# EAGLE design ESP-Breakout (EAGLE 7.3.0)
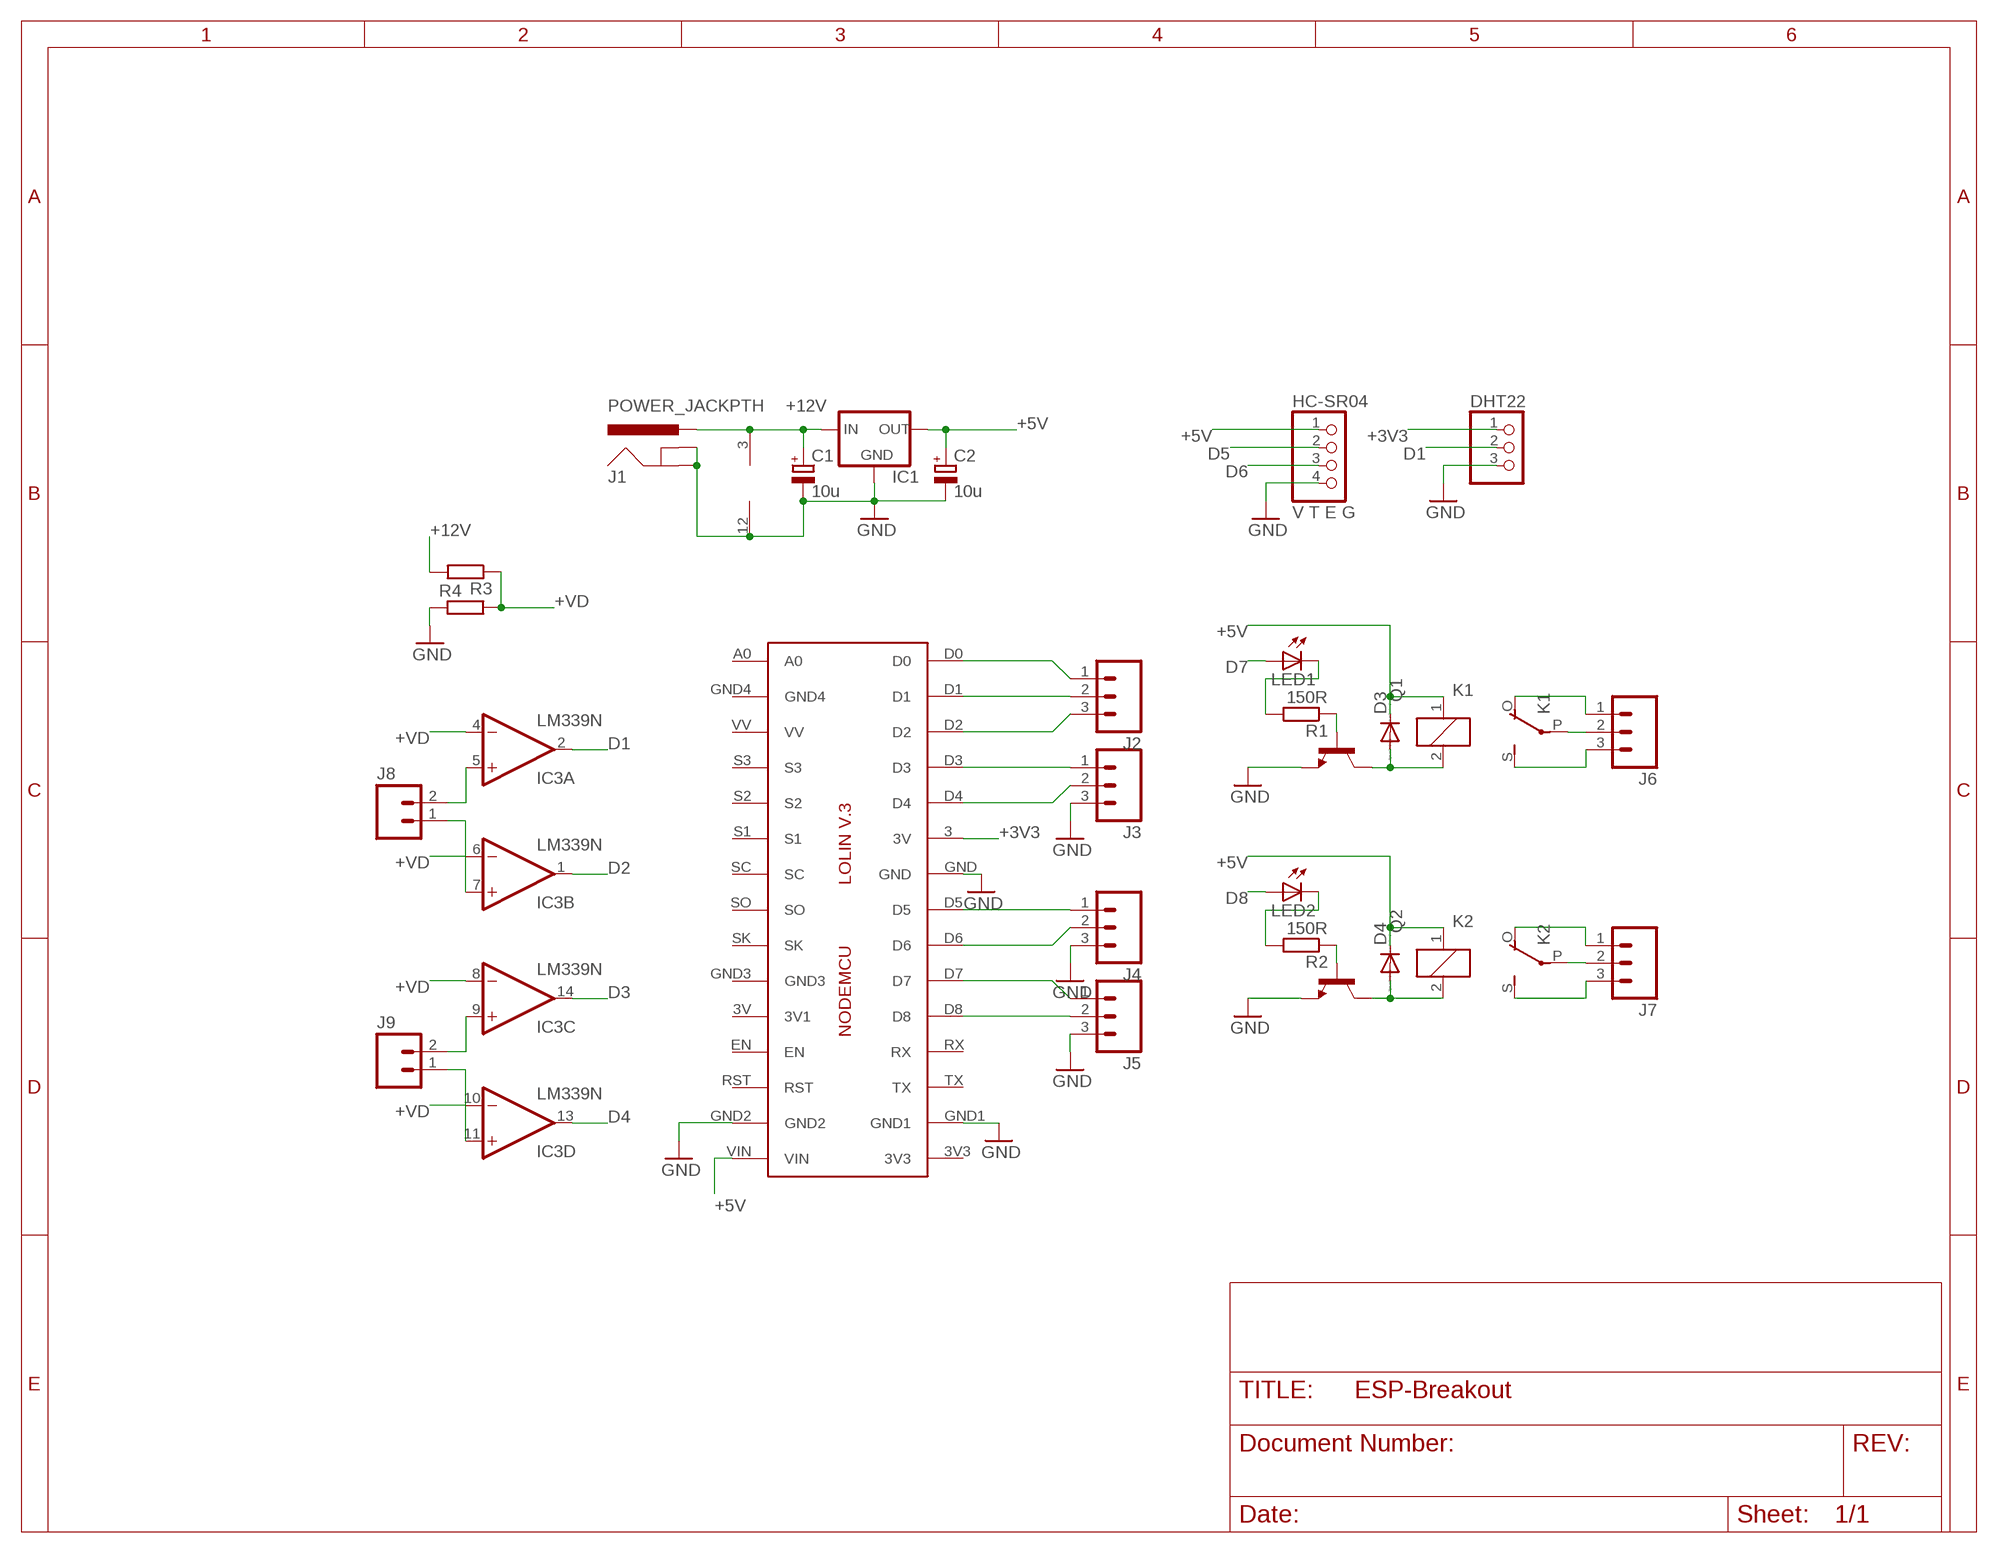
[diagram p0: schematic, sheet 1]

## Parts
C1  10u  CPOL-EUA/3216-18W  [A/3216-18W]
C2  10u  CPOL-EUA/3216-18W  [A/3216-18W]
D3  DIODE-DO214AC  [DO214AC]
D4  DIODE-DO214AC  [DO214AC]
DHT22  PINHD-1X3/90  [1X03/90]
HC-SR04  V T E G  PINHD-1X4  [1X04]
IC1  LM1117  [SOT223]
IC2  LOLINV3  [LOLINV3]
IC3  LM339N  [DIL14]
J1  POWER_JACKPTH  [POWER_JACK_PTH]
J2  M03-SCREW-5MM  [SCREWTERMINAL-5MM-3]
J3  M03-SCREW-5MM  [SCREWTERMINAL-5MM-3]
J4  M03-SCREW-5MM  [SCREWTERMINAL-5MM-3]
J5  M03-SCREW-5MM  [SCREWTERMINAL-5MM-3]
J6  M03-SCREW-5MM  [SCREWTERMINAL-5MM-3]
J7  M03-SCREW-5MM  [SCREWTERMINAL-5MM-3]
J8  M025MM  [SCREWTERMINAL-5MM-2]
J9  M025MM  [SCREWTERMINAL-5MM-2]
K1  ZF112  [ZF112]
K2  ZF112  [ZF112]
LED1  LEDCHIP-LED0805  [CHIP-LED0805]
LED2  LEDCHIP-LED0805  [CHIP-LED0805]
Q1  BC850SMD  [SOT23-BEC]
Q2  BC850SMD  [SOT23-BEC]
R1  150R  R-EU_R0805  [R0805]
R2  150R  R-EU_R0805  [R0805]
R3  R-EU_0204/7  [0204/7]
R4  R-EU_0204/7  [0204/7]

## Nets
+3V3: DHT22.1 IC2.3(3V)
+5V: C2.+ D3.C D4.C HC-SR04.1 IC1.2(OUT) IC2.VIN K1.1 K2.1
+12V: C1.+ IC1.3(IN) IC3.3(P:V+) J1.PWR R3.2
+VD: IC3.4(A:-IN) IC3.6(B:-IN) IC3.8(C:-IN) IC3.10(D:-IN) R3.1 R4.2
D0: IC2.D0 J2.1
D1: DHT22.2 IC2.D1 IC3.2(A:OUT) J2.2
D2: IC2.D2 IC3.1(B:OUT) J2.3
D3: IC2.D3 IC3.14(C:OUT) J3.1
D4: IC2.D4 IC3.13(D:OUT) J3.2
D5: HC-SR04.2 IC2.D5 J4.1
D6: HC-SR04.3 IC2.D6 J4.2
D7: IC2.D7 J5.1 LED1.A
D8: IC2.D8 J5.2 LED2.A
GND: C1.- C2.- DHT22.3 HC-SR04.4 IC1.1(GND) IC2.GND IC2.GND1 IC2.GND2 IC3.12(P:GND) J1.GND J1.GNDBREAK J3.3 J4.3 J5.3 Q1.E Q2.E R4.1
N$1: IC3.5(A:+IN) J8.2
N$2: IC3.7(B:+IN) J8.1
N$3: IC3.9(C:+IN) J9.2
N$4: IC3.11(D:+IN) J9.1
N$11: J6.2 K1.P(2:P)
N$12: J6.3 K1.S(2:S)
N$13: J6.1 K1.O(2:O)
N$14: J7.2 K2.P(2:P)
N$15: J7.1 K2.O(2:O)
N$16: J7.3 K2.S(2:S)
N$18: D3.A K1.2 Q1.C
N$19: D4.A K2.2 Q2.C
N$23: Q1.B R1.1
N$24: Q2.B R2.1
N$25: LED1.C R1.2
N$26: LED2.C R2.2
Unconnected: IC2.3V3 IC2.3V(3V1) IC2.A0 IC2.EN IC2.GND3 IC2.GND4 IC2.RST IC2.RX IC2.S1 IC2.S2 IC2.S3 IC2.SC IC2.SK IC2.SO IC2.TX IC2.VV

## Library data of the parts
C1 C2 = rcl:CPOL-EU: POLARIZED CAPACITOR, European symbol
D3 D4 = diode:DIODE-: DIODE
DHT22 = pinhead:PINHD-1X3: PIN HEADER
HC-SR04 = pinhead:PINHD-1X4: PIN HEADER
IC1 = v-reg-3:LM1117
IC2 = Lolin:LOLINV3
IC3 = linear:LM339: Low Power Low Offset Voltage Quad Comparators with open collector; LM139/LM239/LM339/LM2901/LM3302
J1 = SparkFun-Connectors:POWER_JACK: Power Jack This is the standard 5.5mm barrel jack for power. The PTH is the most common, proven, reliable, footprint. The Slot footprint only works if the mill layer is transmitted to the PCB fab house so be warned. Mating wall wart : TOL-00298 (and others); PROD_ID: CONN-08197
J2-J7 = SparkFun-Connectors:M03: Header 3 Standard 3-pin 0.1" header. Use with straight break away headers (SKU : PRT-00116), right angle break away headers (PRT-00553), swiss pins (PRT-00743), machine pins (PRT-00117), and female headers (PRT-00115). Molex polarized connector foot print use with SKU : PRT-08232 with associated crimp pins and housings.; STOREFRONT_ID: PRT-08433
J8 J9 = SparkFun-Connectors:M02: Standard 2-pin 0.1" header. Use with - straight break away headers ( PRT-00116) - right angle break away headers (PRT-00553) - swiss pins (PRT-00743) - machine pins (PRT-00117) - female headers (PRT-00115) Molex polarized connector foot print use with: PRT-08233 with associated crimp pins and housings. 2.54_SCREWTERM for use with PRT-10571. 3.5mm Screw Terminal footprints for PRT-08084 5mm Screw Terminal footprints for use with PRT-08432; STOREFRONT_ID: PRT-08432
K1 K2 = relay:ZF112: RELAY 1 x switch; OC_FARNELL: unknown; OC_NEWARK: unknown
LED1 LED2 = led:LED: LED OSRAM: - CHIPLED LG R971, LG N971, LY N971, LG Q971, LY Q971, LO R971, LY R971 LH N974, LH R974 LS Q976, LO Q976, LY Q976 LO Q996 - Hyper CHIPLED LW Q18S LB Q993, LB Q99A, LB R99A - SideLED LS A670, LO A670, LY A670, LG A670, LP A670 LB A673, LV A673, LT A673, LW A673 LH A674 LY A675 LS A676, LA A676, LO A676, LY A676, LW A676 LS A679, LY A679, LG A679 - Hyper Micro SIDELED® LS Y876, LA Y876, LO Y876, LY Y876 LT Y87S - SmartLED LW L88C, LW L88S LB L89C, LB L89S, LG L890 LS L89K, LO L89K, LY L89K LS L896, LA L896, LO L896, LY L896 - TOPLED LS T670, LO T670, LY T670, LG T670, LP T670 LSG T670, LSP T670, LSY T670, LOP T670, LYG T670 LG T671, LOG T671, LSG T671 LB T673, LV T673, LT T673, LW T673 LH T674 LS T676, LA T676, LO T676, LY T676, LB T676, LH T676, LSB T676, LW T676 LB T67C, LV T67C, LT T67C, LS T67K, LO T67K, LY T67K, LW E67C LS E67B, LA E67B, LO E67B, LY E67B, LB E67C, LV E67C, LT E67C LW T67C LS T679, LY T679, LG T679 LS T770, LO T770, LY T770, LG T770, LP T770 LB T773, LV T773, LT T773, LW T773 LH T774 LS E675, LA E675, LY E675, LS T675 LS T776, LA T776, LO T776, LY T776, LB T776 LHGB T686 LT T68C, LB T68C - Hyper Mini TOPLED® LB M676 - Mini TOPLED Santana® LG M470 LS M47K, LO M47K, LY M47K Source: http://www.osram.convergy.de LUXEON: - LUMILED® LXK2-PW12-R00, LXK2-PW12-S00, LXK2-PW14-U00, LXK2-PW14-V00 LXK2-PM12-R00, LXK2-PM12-S00, LXK2-PM14-U00 LXK2-PE12-Q00, LXK2-PE12-R00, LXK2-PE12-S00, LXK2-PE14-T00, LXK2-PE14-U00 LXK2-PB12-K00, LXK2-PB12-L00, LXK2-PB12-M00, LXK2-PB14-N00, LXK2-PB14-P00, LXK2-PB14-Q00 LXK2-PR12-L00, LXK2-PR12-M00, LXK2-PR14-Q00, LXK2-PR14-R00 LXK2-PD12-Q00, LXK2-PD12-R00, LXK2-PD12-S00 LXK2-PH12-R00, LXK2-PH12-S00 LXK2-PL12-P00, LXK2-PL12-Q00, LXK2-PL12-R00 Source: www.luxeon.com KINGBRIGHT: KA-3528ASYC Source: www.kingbright.com
Q1 Q2 = transistor-npn:BC850*: NPN Transistor
R1-R4 = rcl:R-EU_: RESISTOR, European symbol

## Board
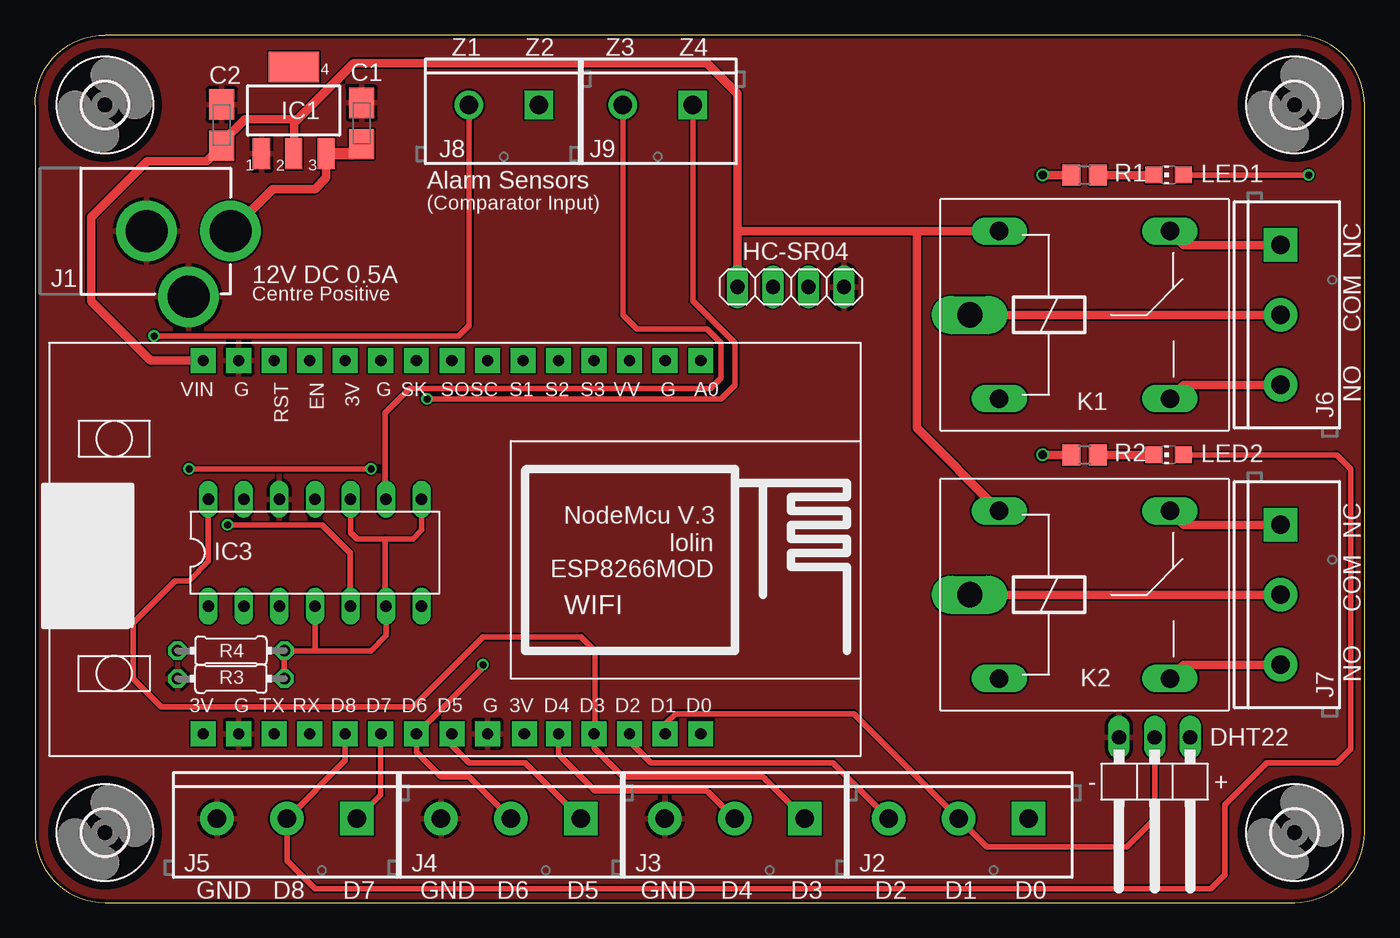
[diagram p1: board, top side]
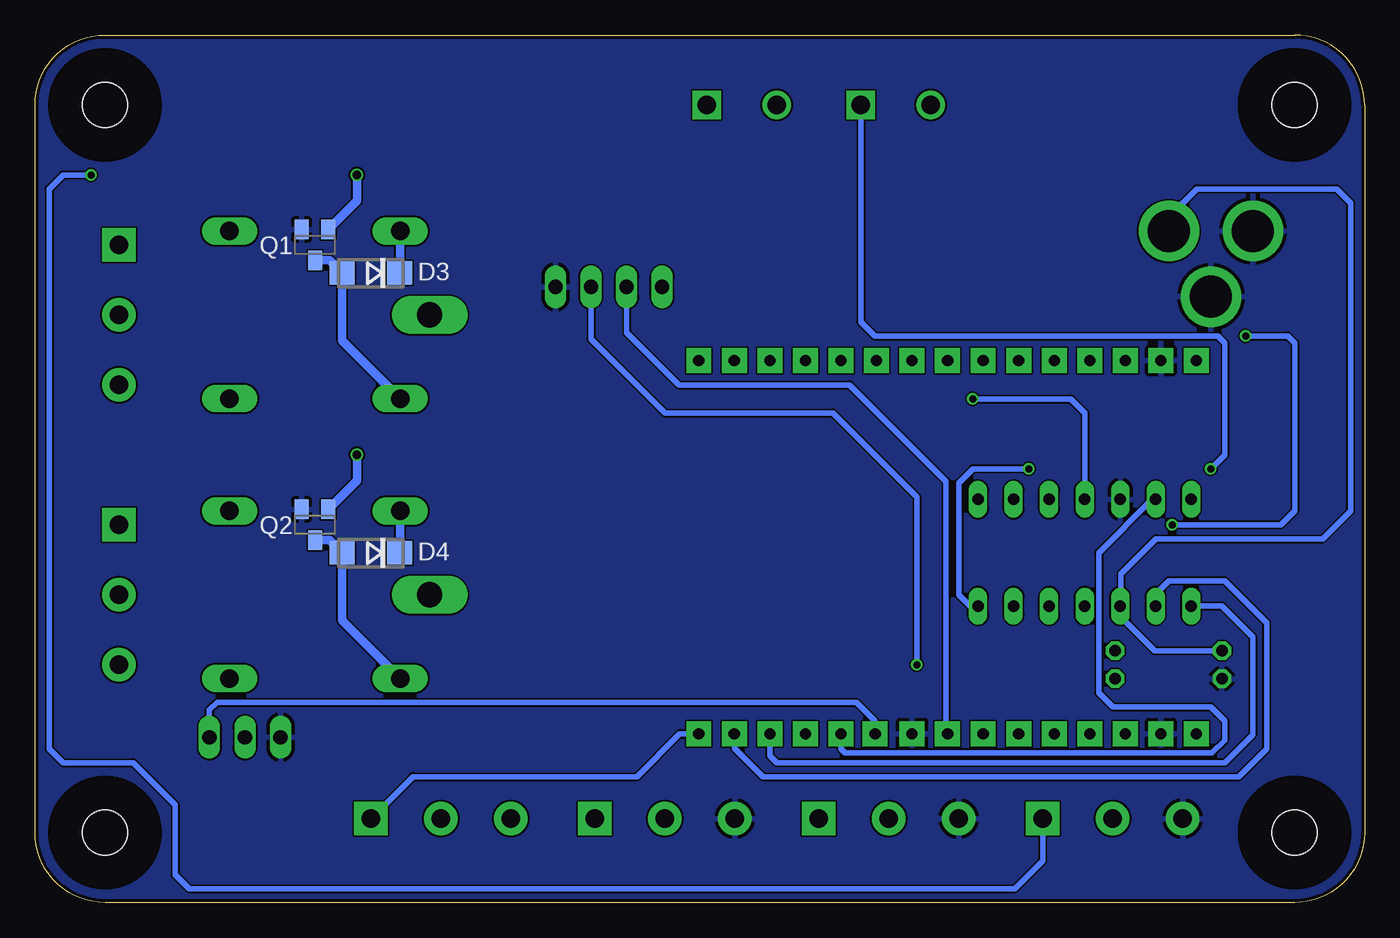
[diagram p2: board, bottom side, seen from below]

Size 95 x 62 mm. Coordinates in mm from the lower left corner, seen from the top.
Outline: 5,0 90,0 arc90 95,5 95,57 arc90 90,62 5,62 arc90 0,57 0,5 arc90 5,0
Copper layers (1*16): Top 0.035mm / dielectric 1.5mm / Bottom 0.035mm
Design rules "dirt_cheap_dirty_boards.v1": minimum track width 5mil, minimum drill 12mil, track to track 5mil, track to pad 5mil, pad to pad 5mil, via to via 5mil, smd to smd 0mil, copper to edge 10mil, drill to drill 10mil, minimum pad ring 10mil, minimum via ring 6mil, stop-mask expansion 2mil, vias tented up to drill 25mil, thermal gap 10mil

### Footprints (pad centres in the part's own frame; a part is rotated, then mirrored left to right if it is on the bottom)
A/3216-18W = smd 2.15 x 1.8: + 1.475,0; - -1.475,0
DO214AC = smd 1.8 x 1.7: A 2.05,0; C -2.05,0
1X03/90 = drill 1.016 long: 1 -2.54,-3.81; 2 0,-3.81; 3 2.54,-3.81
1X04 = drill 1.016 long: 1 -3.81,0; 2 -1.27,0; 3 1.27,0; 4 3.81,0
SOT223 = smd 1.219 x 2.235: 1 -2.311,-3.099; 2 0,-3.099; 3 2.311,-3.099 | smd 3.6 x 2.2: 4 0,3.099
LOLINV3 = drill 0.8 pad 1.778 square: 3 -4.97,12.94; 3V 17.99,12.94; 3V3 7.83,-13.73; A0 -17.57,-13.73; D0 -17.57,12.94; D1 -15.03,12.94; D2 -12.49,12.94; D3 -9.95,12.94; D4 -7.41,12.94; D5 0.21,12.94; D6 2.75,12.94; D7 5.29,12.94; D8 7.83,12.94; EN 10.37,-13.73; GND -2.33,12.94; GND1 15.45,12.94; GND2 15.45,-13.73; GND3 5.29,-13.73; GND4 -15.03,-13.73; RST 12.91,-13.73; RX 10.37,12.94; S1 -4.87,-13.73; S2 -7.41,-13.73; S3 -9.95,-13.73; SC -2.33,-13.73; SK 2.75,-13.73; SO 0.21,-13.73; TX 12.91,12.94; VIN 17.99,-13.73; VV -12.49,-13.73
DIL14 = drill 0.813 long: 1 -7.62,-3.81; 2 -5.08,-3.81; 3 -2.54,-3.81; 4 0,-3.81; 5 2.54,-3.81; 6 5.08,-3.81; 7 7.62,-3.81; 8 7.62,3.81; 9 5.08,3.81; 10 2.54,3.81; 11 0,3.81; 12 -2.54,3.81; 13 -5.08,3.81; 14 -7.62,3.81
POWER_JACK_PTH = drill 2.997 pad 4.318: GND 0,7.7; GNDBREAK 4.7,10.7; PWR 0,13.7
SCREWTERMINAL-5MM-3 = drill 1.3 pad 2.413 square: 1 0,0 | drill 1.3 pad 2.413: 2 5,0; 3 10,0
SCREWTERMINAL-5MM-2 = drill 1.3 pad 2.032 square: 1 0,0 | drill 1.3 pad 2.032: 2 5,0
ZF112 = drill 1.321 long: 1 -6.096,5.994; 2 -6.096,-5.994; O 6.096,5.994; S 6.096,-5.994 | drill 1.803 long: P -8.204,0
CHIP-LED0805 = smd 1.2 x 1.2: A 0,-1.05; C 0,1.05
SOT23-BEC = smd 1 x 1.4: B -0.95,-1.1; C 0,1.1; E 0.95,-1.1
R0805 = smd 1.3 x 1.5: 1 -0.95,0; 2 0.95,0
0204/7 = drill 0.813 octagon: 1 -3.81,0; 2 3.81,0
3,2 = hole 3.2: 0,0

### Placement (x,y rotation side)
C1  23.34,55.67 270 top
C2  13.34,55.56 270 top
D3  71,45 180 bottom
D4  71,25 180 bottom
DHT22  80,8 180 top
HC-SR04  54,44 0 top
IC1  18.49,56.61 0 top
IC2  30,25 180 top
IC3  20,25 0 top
J1  0.27,47.99 270 top
J2  71,6 180 top
J3  55,6 180 top
J4  39,6 180 top
J5  23,6 180 top
J6  89,47 270 top
J7  89,27 270 top
J8  36,57 180 top
J9  47,57 180 top
K1  75,42 0 top
K2  75,22 0 top
LED1  81,52 90 top
LED2  81,32 90 top
Q1  75,47 180 bottom
Q2  75,27 180 bottom
R1  75,52 0 top
R2  75,32 0 top
R3  14,18 180 top
R4  14,16 0 top
U$2  [3,2]  5,57 0 top
U$3  [3,2]  90,57 0 top
U$4  [3,2]  90,5 0 top
U$5  [3,2]  5,5 0 top

### Tracks (layer width: path | path; a pad name or v marks a point on that pad's centre or on a via)
+3V3
  Bottom 0.406: DHT22.1 82.54,13.76 82,14.3 36.3,14.3 35,13 35,12.09 IC2.3
+5V
  Top 0.61: IC2.VIN 8.27,38.73 4,43 4,49 8,53 12.26,53 C2.+ 13.34,54.34 15,56 18.75,56 | HC-SR04.1 50.19,48 | 50.19,48 50.19,57.81 48,60 22.75,60 18.75,56 | 18.75,56 18.5,55.75 18.5,53.52 IC1.2 | K1.1 63,48 | 63,48 50.19,48 | K2.1 63,33.9 63,48
  Bottom 0.61: D4.C 68.9,25.05 K2.1 | D3.C 68.9,45.05 K1.1
+12V
  Top 0.61: J1.PWR 16.98,51 20,51 20.8,51.8 IC1.3
  Top 0.813: IC1.3 22.66,53.51 C1.+
  Bottom 0.406: R3.2 15,18 17.46,20.46 IC3.3 17.4,21.25 17.4,23.5 14.9,26 3,26 1,28 1,50 2,51 12,51 13.97,49.03 J1.PWR
+VD
  Top 0.406: R4.2 R3.1 20,18 | 20,18 24,18 25.08,19.08 IC3.6 25,21.27 25,26 | IC3.4 20,18 | IC3.10 22.54,26.46 23,26 25,26 | 25,26 27,26 27.62,26.62 IC3.8
D0
  Bottom 0.406: J2.1 68,9 52,9 48.94,12.06 IC2.D0
D1
  Top 0.406: IC2.D1 45.03,12.78 45.75,13.5 58.5,13.5 J2.2 68,4 78,4 80,6 DHT22.2
  Bottom 0.406: IC2.D1 45.03,11.03 43,9 9,9 7,11 7,20 10,23 14,23 15,22 15,21.27 IC3.2
D2
  Top 0.406: J2.3 57,10 44,10 42.49,11.51 IC2.D2
  Bottom 0.406: IC3.1 10.19,21.19 8,19 8,12 10,10 42,10 42.49,10.49 IC2.D2
D3
  Top 0.406: J3.1 52,9 42,9 39.95,11.05 IC2.D3 40,12.11 40,18 39,19 32,19 27,14 9,14 7,16 7,20 10,23 11,23 12.38,24.38 IC3.14
D4
  Top 0.406: J3.2 48,8 40,8 37.41,10.59 IC2.D4
  Bottom 0.406: IC3.13 15.19,28.81 19,25 19,15 18,14 11,14 10,13 10,11.6 10.9,10.7 37.11,10.7 37.41,11 IC2.D4
D5
  Top 0.406: J4.1 35,10 31,10 29.79,11.21 IC2.D5
  Bottom 0.406: HC-SR04.2 52.73,40.73 49,37 36.8,37 29.9,30.1 29.9,12.17 IC2.D5
D6  (via drill 0.5)
  Top 0.406: J4.2 31,9 29,9 27.25,10.75 IC2.D6 32,16.81 v32,17
  Bottom 0.406: HC-SR04.3 55.27,40.27 50,35 38,35 32,29 v32,17
D7  (via drill 0.5)
  Top 0.406: J5.1 24.71,7.71 IC2.D7 | LED1.A v91,52
  Bottom 0.406: v91,52 93,52 94,51 94,11 93,10 88,10 85,7 85,2 84,1 25,1 23,3 J5.1
D8
  Top 0.406: IC2.D8 22.17,10.17 J5.2 18,3 20,1 84,1 85,2 85,7 88,10 93,10 94,11 94,31 93,32 LED2.A
GND
  pour Bottom: 5,0 90,0 arc90 95,5 95,57 arc90 90,62 5,62 arc90 0,57 0,5 arc90
  pour Top: 5,0 90,0 arc90 95,5 95,57 arc90 90,62 5,62 arc90 0,57 0,5 arc90
N$1  (via drill 0.5)
  Top 0.406: J8.2 31,41.25 30.25,40.5 v8.5,40.5 | v13.75,27 20.5,27 22.5,25 22.5,21.23 IC3.5
  Bottom 0.406: v8.5,40.5 5.5,40.5 5,40 5,28 6,27 v13.75,27
N$2  (via drill 0.5)
  Top 0.406: v11,31 v24,31
  Bottom 0.406: J8.1 36,41.5 35,40.5 10.5,40.5 10,40 10,32 v11,31 | v24,31 28,31 29,30 29,22 28.19,21.19 IC3.7
N$3
  Top 0.406: J9.2 42,42 43,41 48,41 49,40 49,37.5 48.25,36.75 26.75,36.75 25,35 25,28.89 IC3.9
N$4  (via drill 0.5)
  Top 0.406: J9.1 47,43 50,40 50,37 49,36 v28,36
  Bottom 0.406: v28,36 21,36 20,35 IC3.11
N$11
  Top 0.61: J6.2 K1.P
N$12
  Top 0.61: K1.S 82.09,37 J6.3
N$13
  Top 0.61: K1.O 82.09,47 J6.1
N$14
  Top 0.61: J7.2 K2.P
N$15
  Top 0.61: K2.O 82.09,27 J7.1
N$16
  Top 0.61: K2.S 82.09,17 J7.3
N$18
  Bottom 0.61: Q1.C 73.95,45.9 D3.A 73.05,40.15 K1.2
N$19
  Bottom 0.61: K2.2 73.05,20.15 D4.A 73.95,25.9 Q2.C
N$23  (via drill 0.6)
  Top 0.61: v72,52 R1.1
  Bottom 0.61: Q1.B 72,50.15 v72,52
N$24  (via drill 0.6)
  Top 0.61: v72,32 R2.1
  Bottom 0.61: Q2.B 72,30.15 v72,32
N$25
  Top 0.61: R1.2 LED1.C
N$26
  Top 0.61: R2.2 LED2.C

### Text on the board
tNames: Z1 | Z2 | Z3 | Z4 | Alarm Sensors | (Comparator Input) | NC | 12V DC 0.5A | Centre Positive | COM | NO | NC | COM | NO | - | + | GND | D8 | D7 | GND | D6 | D5 | GND | D4 | D3 | D2 | D1 | D0